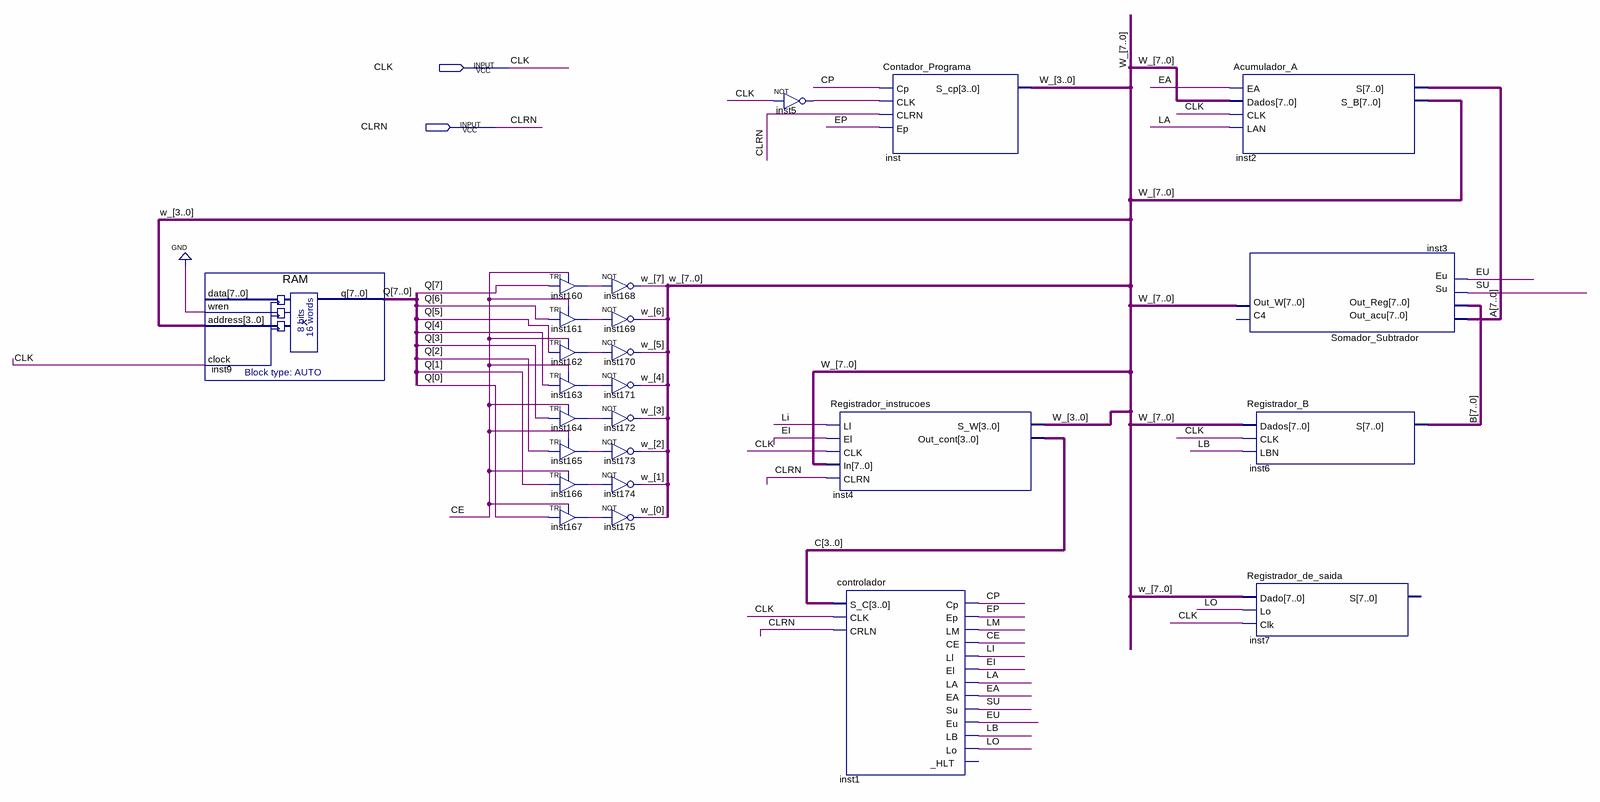
[diagram p0: schematic sheet]
// Quartus schematic Micro_Computador.bdf as structural Verilog: 25 symbols, 2 pins
module Micro_Computador (
  input  CLK,
  input  CLRN
);

  wire CE, CP, EA, EI, EP, EU, inst5_out, inst160_out, inst161_out, inst162_out, inst163_out, inst164_out,
       inst165_out, inst166_out, inst167_out, LA, LB, Li, LM, LO, SU;
  wire [3:0] C;
  wire [7:0] A, B, Q, W_;

  RAM inst9 (.wren(1'b0), .address(W_[3:0]), .clock(CLK), .q(Q));  // open: data
  TRI inst160 (.IN(Q[7]), .OE(CE), .OUT(inst160_out));
  TRI inst161 (.IN(Q[6]), .OE(CE), .OUT(inst161_out));
  TRI inst162 (.IN(Q[5]), .OE(CE), .OUT(inst162_out));
  TRI inst163 (.IN(Q[4]), .OE(CE), .OUT(inst163_out));
  TRI inst164 (.IN(Q[3]), .OE(CE), .OUT(inst164_out));
  TRI inst165 (.IN(Q[2]), .OE(CE), .OUT(inst165_out));
  TRI inst166 (.IN(Q[1]), .OE(CE), .OUT(inst166_out));
  TRI inst167 (.IN(Q[0]), .OE(CE), .OUT(inst167_out));
  not inst168 (W_[7], inst160_out);
  not inst169 (W_[6], inst161_out);
  not inst170 (W_[5], inst162_out);
  not inst171 (W_[4], inst163_out);
  not inst172 (W_[3], inst164_out);
  not inst173 (W_[2], inst165_out);
  not inst174 (W_[1], inst166_out);
  not inst175 (W_[0], inst167_out);
  not inst5 (inst5_out, CLK);
  Registrador_instrucoes inst4 (.Ll(Li), .El(EI), .CLK(CLK), .In(W_), .CLRN(CLRN), .S_W(W_[3:0]), .Out_cont(C));
  controlador inst1 (
    .S_C(C), .CLK(CLK), .CRLN(CLRN), .Cp(CP), .Ep(EP), .LM(LM), .CE(CE), .Ll(Li), .El(EI), .LA(LA), .EA(EA),
    .Su(SU), .Eu(EU), .LB(LB), .Lo(LO));  // open: _HLT
  Contador_Programa inst (.Cp(CP), .CLK(inst5_out), .CLRN(CLRN), .Ep(EP), .S_cp(W_[3:0]));
  Acumulador_A inst2 (.EA(EA), .Dados(W_), .CLK(CLK), .LAN(LA), .S(A), .S_B(W_));
  Somador_Subtrador inst3 (.Out_acu(A), .Out_Reg(B), .Su(SU), .Eu(EU), .Out_W(W_));  // open: C4
  Registrador_B inst6 (.Dados(W_), .CLK(CLK), .LBN(LB), .S(B));
  Registrador_de_saida inst7 (.Dado(W_), .Lo(LO), .Clk(CLK));  // open: S
endmodule
